# Altium project KinetisCANBoard.PrjPCB
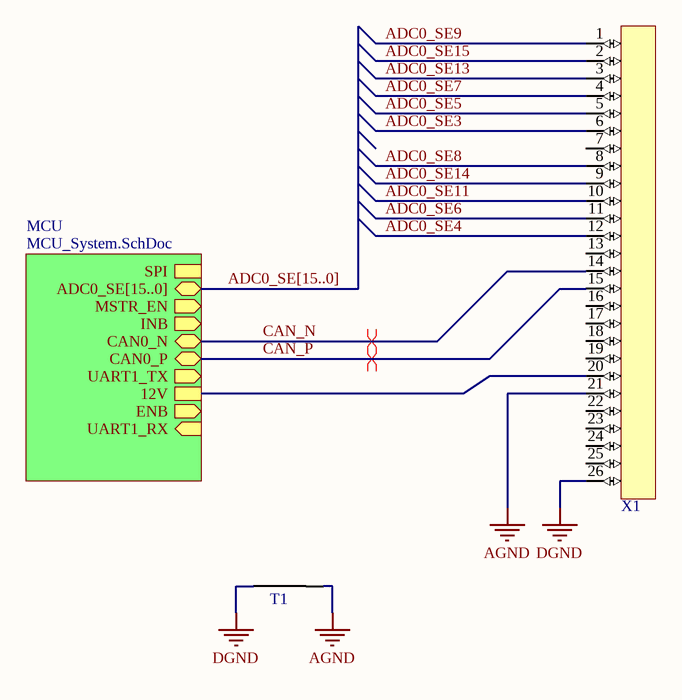
[diagram p0: KinetisCANBoard.SchDoc]
1 sheet, 2 parts. Net scope: hierarchical (ports join the sheet entries above them; power ports are global).
Board file: Board.PcbDoc

## Sheet KinetisCANBoard.SchDoc
size A

### Parts
T1  Net Tie  [Net Tie 10mil]  (value not drawn)  (net tie, no BOM)
X1  TE Superseal 26 POS  [TE_SUPERSEAL_26]  (value not drawn)

### Sub-sheets
MCU = MCU_System.SchDoc (file not in this document): SPI (harness SPI), ADC0_SE[15..0] (bidir), MSTR_EN (out), INB (out), CAN0_N (bidir), CAN0_P (bidir), UART1_TX (out), 12V, ENB (out), UART1_RX (in)

### Nets
AGND: T1.2 X1.21
DGND: T1.1 X1.26
ADC0_SE3: X1.6
ADC0_SE4: X1.12
ADC0_SE5: X1.5
ADC0_SE6: X1.11
ADC0_SE7: X1.4
ADC0_SE8: X1.8
ADC0_SE9: X1.1
ADC0_SE11: X1.10
ADC0_SE13: X1.3
ADC0_SE14: X1.9
ADC0_SE15: X1.2
CAN_N: X1.14 ; sheet MCU/CAN0_N
CAN_P: X1.15 ; sheet MCU/CAN0_P
NetX1_20: X1.20 ; sheet MCU/12V

Not connected (* = marked no-connect by the designer): X1 7 13 16 17 18 19 22 23 24 25

### Buses and harness runs
bus ADC0_SE[15..0] = sheet MCU/ADC0_SE[15..0]

### Layout directives
differential pair: CAN_N, CAN_P